# EAGLE design jammer_smdv3 (EAGLE 6.5.0)
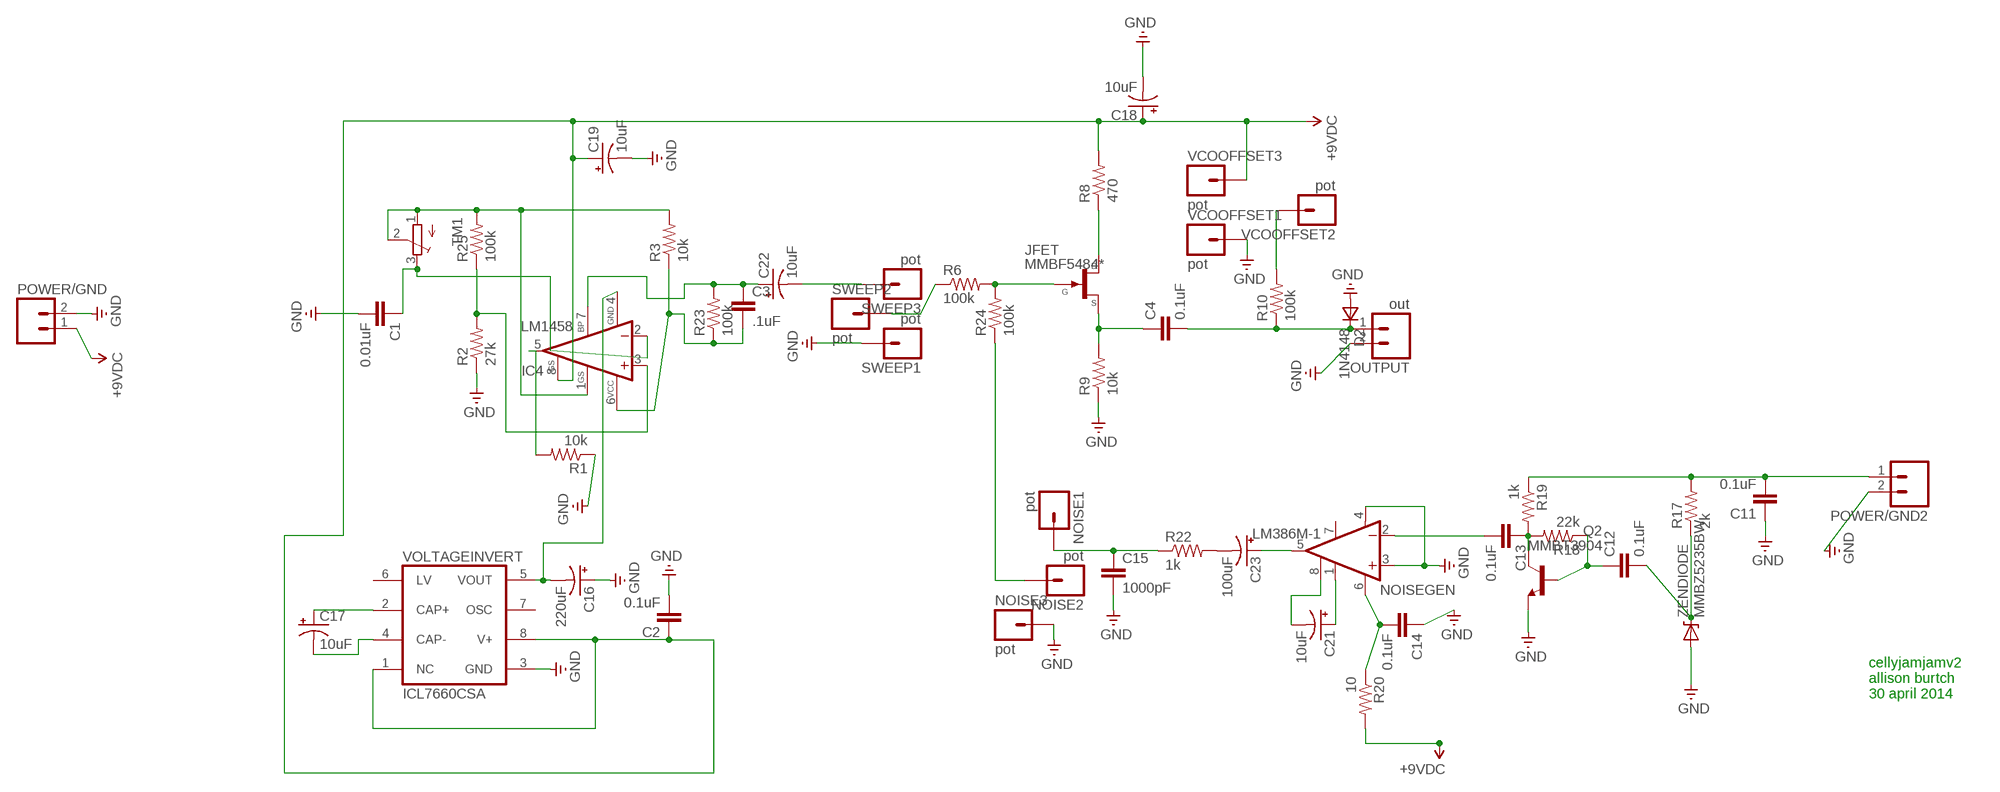
[diagram p0: schematic, sheet 1]

## Parts
C1  0.01uF  CAP0603-CAP  [0603-CAP]
C2  0.1uF  CAP0603-CAP  [0603-CAP]
C3  .1uF  CAP0603-CAP  [0603-CAP]
C4  0.1uF  CAP0603-CAP  [0603-CAP]
C11  0.1uF  CAP0603-CAP  [0603-CAP]
C12  0.1uF  CAP0603-CAP  [0603-CAP]
C13  0.1uF  CAP0603-CAP  [0603-CAP]
C14  0.1uF  CAP0603-CAP  [0603-CAP]
C15  1000pF  CAP0603-CAP  [0603-CAP]
C16  220uF  CAP_POLD  [PANASONIC_D]
C17  10uF  CAP_POLC  [PANASONIC_C]
C18  10uF  CAP_POL1206  [EIA3216]
C19  10uF  CAP_POL1206  [EIA3216]
C21  10uF  CAP_POL1206  [EIA3216]
C22  10uF  CAP_POLC  [PANASONIC_C]
C23  100uF  CAP_POLPTH1  [CPOL-RADIAL-100UF-25V]
D2  1N4148  DSOD323  [SOD323]
IC4  LM1458  LM386M  [SO08@2]
JFET  MMBF5484*  MMBF5484  [SOT23]
NOISE1  pot  M01PTH  [1X01]
NOISE2  pot  M01PTH  [1X01]
NOISE3  pot  M01PTH  [1X01]
NOISEGEN  LM386M-1  [SO08]
OUTPUT  out  M02LOCK_LONGPADS  [1X02_LOCK_LONGPADS]
POWER/GND  M02LOCK_LONGPADS  [1X02_LOCK_LONGPADS]
POWER/GND2  M02LOCK_LONGPADS  [1X02_LOCK_LONGPADS]
Q2  MMBT3904  [SOT23-BEC]
R1  10k  RESISTOR0603-RES  [0603-RES]
R2  27k  RESISTOR0603-RES  [0603-RES]
R3  10k  RESISTOR0603-RES  [0603-RES]
R6  100k  RESISTOR0603-RES  [0603-RES]
R8  470  RESISTOR0603-RES  [0603-RES]
R9  10k  RESISTOR0603-RES  [0603-RES]
R10  100k  RESISTOR0603-RES  [0603-RES]
R17  2k  RESISTOR0603-RES  [0603-RES]
R18  22k  RESISTOR0603-RES  [0603-RES]
R19  1k  RESISTOR0603-RES  [0603-RES]
R20  10  RESISTOR0603-RES  [0603-RES]
R22  1k  RESISTOR0603-RES  [0603-RES]
R23  100k  RESISTOR0603-RES  [0603-RES]
R24  100k  RESISTOR0603-RES  [0603-RES]
R25  100k  RESISTOR0603-RES  [0603-RES]
SWEEP1  pot  M01PTH  [1X01]
SWEEP2  pot  M01PTH  [1X01]
SWEEP3  pot  M01PTH  [1X01]
TM1  TRIMPOTTC33X  [TC33X]
VCOOFFSET1  pot  M01PTH  [1X01]
VCOOFFSET2  pot  M01PTH  [1X01]
VCOOFFSET3  pot  M01PTH  [1X01]
VOLTAGEINVERT  ICL7660CSA  [SO08]
ZENDIODE  MMBZ5235BW  DIODE-ZENERPTH  [DIODE-ZENER]

## Nets
GND: C1.2 C2.2 C11.1 C14.1 C15.2 C16.+ C18.C(-) C19.C(-) D2.2(A) NOISE3.1 NOISEGEN.3(+IN) NOISEGEN.4(GND) OUTPUT.2 POWER/GND2.2 POWER/GND.2 Q2.E R1.1 R2.1 R9.1 SWEEP1.1 VCOOFFSET1.1 VOLTAGEINVERT.3(GND) ZENDIODE.P$2(A)
N$4: C17.+ VOLTAGEINVERT.2(CAP+)
N$5: C17.- VOLTAGEINVERT.4(CAP-)
N$6: C21.A(+) NOISEGEN.1(GAIN)
N$7: C16.- IC4.4(GND) VOLTAGEINVERT.5(VOUT)
N$8: IC4.1(GAIN) R3.2 R25.2 TM1.1(A) TM1.2(S)
N$10: C1.1 IC4.2(-IN) TM1.3(E)
N$11: R6.1 SWEEP2.1
N$12: C22.- SWEEP3.1
N$14: C3.2 IC4.6(VS) R3.1 R23.1
N$15: C21.C(-) NOISEGEN.8(GAIN)
N$16: C12.1 Q2.B R18.1
N$18: C13.2 NOISEGEN.2(-IN)
N$19: C13.1 Q2.C R18.2 R19.2
N$20: C12.2 R17.1 ZENDIODE.P$1(C)
N$21: C23.2(-) R22.2
N$22: C23.1(+) NOISEGEN.5(OUT)
N$23: C15.1 NOISE1.1 R22.1
N$24: C3.1 C22.+ IC4.7(BS2) R23.2
N$25: NOISE2.1 R24.1
N$26: C14.2 NOISEGEN.6(VS) R20.1
N$27: JFET.1(D) R8.1
N$30: C4.1 JFET.2(S) R9.2
N$31: R10.2 VCOOFFSET2.1
N$33: C11.2 POWER/GND2.1 R17.2 R19.1
N$47: JFET.3(G) R6.2 R24.2
N$48: IC4.5(OUT) R1.2
N$49: IC4.3(+IN) R2.2 R25.1
N$52: C4.2 D2.1(C) OUTPUT.1 R10.1
VCC: C2.1 C18.A(+) C19.A(+) IC4.8(GAIN) POWER/GND.1 R8.2 R20.2 VCOOFFSET3.1 VOLTAGEINVERT.1(NC) VOLTAGEINVERT.8(V+) ; supply symbol labelled +9VDC
Unconnected: NOISEGEN.7(BYPASS) VOLTAGEINVERT.6(LV) VOLTAGEINVERT.7(OSC)

## Notes on the sheet
- cellyjamjamv2
  allison burtch
  30 april 2014

## Library data of the parts
C1-C4 C11-C15 = SparkFun-Passives:CAP: Capacitor Standard 0603 ceramic capacitor, and 0.1" leaded capacitor.
C16-C19 C21-C23 = SparkFun-Capacitors:CAP_POL: Capacitor Polarized These are standard SMD and PTH capacitors. Normally 10uF, 47uF, and 100uF in electrolytic and tantalum varieties. Always verify the external diameter of the through hole cap, it varies with capacity, voltage, and manufacturer. The EIA devices should be standard.
D2 = zetex:D: DIODE; MPN: CDSOD323-T05C; OC_FARNELL: 1824860; OC_NEWARK: 79R6078
IC4 = linear:LM386: Low Voltage Audio Power Amplifier
JFET = transistor-fet:MMBF5484*: N-Channel JFET
NOISE1-NOISE3 SWEEP1-SWEEP3 VCOOFFSET1-VCOOFFSET3 = SparkFun-Connectors:M01: Header 1 Standard 1-pin 0.1" header. Use with straight break away headers (SKU : PRT-00116), right angle break away headers (PRT-00553), swiss pins (PRT-00743), machine pins (PRT-00117), and female headers (PRT-00115).
NOISEGEN = linear:LM386?-*: Low Voltage Audio Power Amplifier Source: http://cache.national.com/ds/LM/LM386.pdf
OUTPUT POWER/GND POWER/GND2 = SparkFun-Connectors:M02: Standard 2-pin 0.1" header. Use with - straight break away headers ( PRT-00116) - right angle break away headers (PRT-00553) - swiss pins (PRT-00743) - machine pins (PRT-00117) - female headers (PRT-00115) Molex polarized connector foot print use with: PRT-08233 with associated crimp pins and housings. 2.54_SCREWTERM for use with PRT-10571. 3.5mm Screw Terminal footprints for PRT-08084 5mm Screw Terminal footprints for use with PRT-08433
Q2 = transistor-npn:MMBT3904*: NPN TRANSISTOR
R1-R3 R6 R8-R10 R17-R20 R22-R25 = SparkFun-Resistors:RESISTOR: Resistor Basic schematic elements and footprints for 0603, 1206, and PTH resistors.
TM1 = adafruit:TRIMPOT: SMT trimmer potentiometer part number TC33X http://www.ladyada.net/library/eagle
VOLTAGEINVERT = maxim:ICL7660CSA: VOLTAGE CONVERTER; MF: MAXIM; MPN: ICL7660CSA; OC_FARNELL: 9724710; OC_NEWARK: 34C3732
ZENDIODE = SparkFun-DiscreteSemi:DIODE-ZENER: Zener Diode Production Part - 8199 3.4V Zener Voltage

## Board
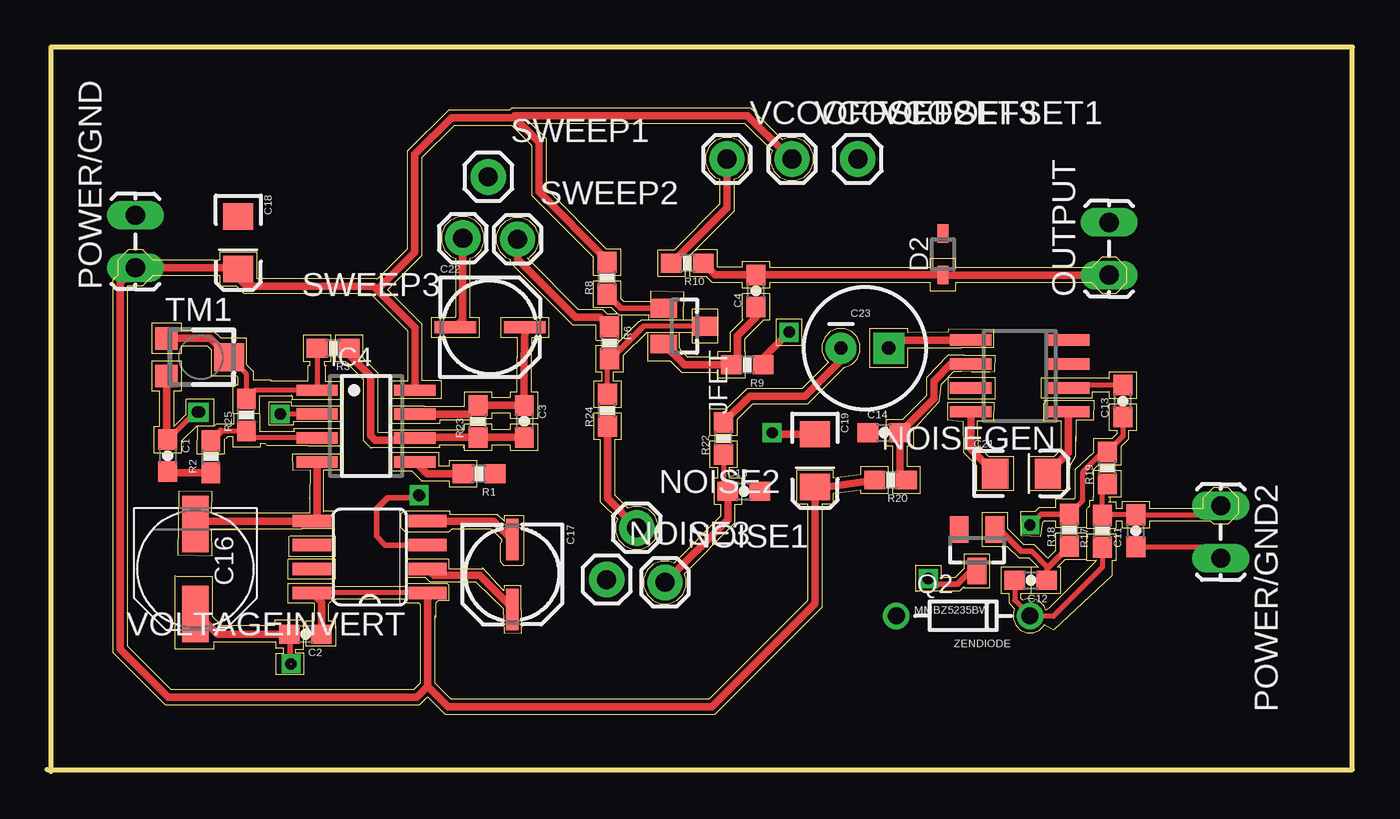
[diagram p1: board, top side]
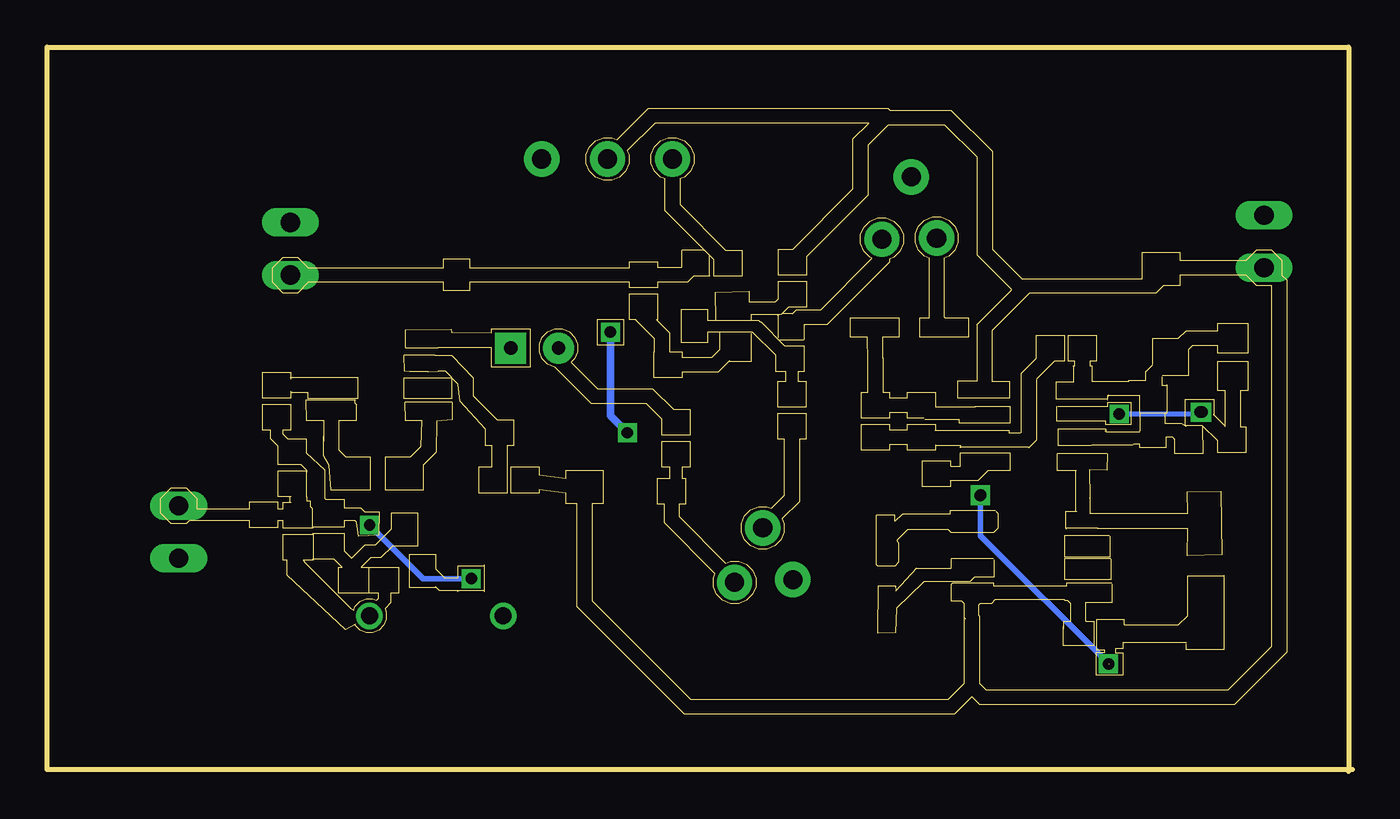
[diagram p2: board, bottom side, seen from below]

Size 69.4 x 38.5 mm. Coordinates in mm from the lower left corner, seen from the top.
Outline: 0,0.1 69.4,0.1 69.4,38.5 0.2,38.5 0.2,0
Copper layers (1*16): Top 0.035mm / dielectric 1.5mm / Bottom 0.035mm
Design rules "default": minimum track width 10mil, minimum drill 24mil, track to track 8mil, track to pad 8mil, pad to pad 8mil, via to via 8mil, smd to smd 8mil, copper to edge 40mil, drill to drill 8mil, minimum pad ring 10mil, minimum via ring 8mil, stop-mask expansion 4mil, vias tented up to drill 0mil, thermal gap 10mil
Milling: 864 lines

### Footprints (pad centres in the part's own frame; a part is rotated, then mirrored left to right if it is on the bottom)
0603-CAP = smd 1.1 x 1: 1 -0.85,0; 2 0.85,0
PANASONIC_D = smd 3 x 1.4: + 2.4,0; - -2.4,0
PANASONIC_C = smd 2.2 x 0.65: + 1.9,-0.2; - -1.8,-0.2
EIA3216 = smd 1.4 x 1.6: A 1.4,0; C -1.4,0
CPOL-RADIAL-100UF-25V = drill 0.7 pad 1.651 square: 1 1.27,0 | drill 0.7 pad 1.651: 2 -1.27,0
SOD323 = smd 1 x 0.6: 1 -1.1,0; 2 1.1,0
SO08@2 = smd 0.6 x 2.2: 1 -1.905,-2.6; 2 -0.635,-2.6; 3 0.635,-2.6; 4 1.905,-2.6; 5 1.905,2.6; 6 0.635,2.6; 7 -0.635,2.6; 8 -1.905,2.6
SOT23 = smd 1 x 1.4: 1 -0.95,-1.1; 2 0.95,-1.1; 3 0,1.1
1X01 = drill 1.016 pad 1.88: 1 0,0
SO08 = smd 0.6 x 2.2: 1 -1.905,-2.6; 2 -0.635,-2.6; 3 0.635,-2.6; 4 1.905,-2.6; 5 1.905,2.6; 6 0.635,2.6; 7 -0.635,2.6; 8 -1.905,2.6
1X02_LOCK_LONGPADS = drill 1.016 long: 1 -0.127,0; 2 2.667,0
SOT23-BEC = smd 1 x 1.4: B -0.95,-1.1; C 0,1.1; E 0.95,-1.1
0603-RES = smd 1.1 x 1: 1 -0.85,0; 2 0.85,0
TC33X = smd 1.2 x 1.2: 1 -1,-1.825; 3 1,-1.825 | smd 1.5 x 1.6: 2 0,1.5
SO08' = smd 0.66 x 2.032: 1 -1.905,-3.073; 2 -0.635,-3.073; 3 0.635,-3.073; 4 1.905,-3.073; 5 1.905,3.073; 6 0.635,3.073; 7 -0.635,3.073; 8 -1.905,3.073
DIODE-ZENER = drill 0.9: P$1 -3.556,0; P$2 3.556,0

### Placement (x,y rotation side)
C1  6.41,16.79 270 top
C2  13.74,7.29 180 top
C3  25.37,18.61 270 top
C4  37.69,25.54 90 top
C11  57.88,12.79 90 top
C12  52.3,10.16 180 top
C13  57.2,19.69 90 top
C14  44.49,18 0 top
C15  37.04,14.9 0 top
C16  7.89,10.76 270 top
C17  24.93,10.52 270 top
C18  10.17,28.1 270 top
C19  40.82,16.52 270 top
C21  51.81,15.83 0 top
C22  23.5,23.8 0 top
C23  43.48,22.5 0 top
D2  47.63,27.49 90 top
IC4  16.96,18.36 270 top
JFET  33.89,23.67 270 top
NOISE1  32.85,10.05 0 top
NOISE2  31.35,12.95 0 top
NOISE3  29.75,10.2 0 top
NOISEGEN  51.71,21.02 90 top
OUTPUT  56.46,26.51 90 top
POWER/GND  4.7,26.9 90 top
POWER/GND2  62.4,14 270 top
Q2  49.44,11.76 180 top
R1  22.97,15.82 180 top
R2  8.71,16.73 90 top
R3  15.21,22.49 180 top
R6  29.9,22.78 270 top
R8  29.78,26.22 90 top
R9  37.23,21.61 180 top
R10  34.04,27.01 180 top
R17  56.11,12.77 90 top
R18  54.35,12.82 90 top
R19  56.37,16.13 90 top
R20  44.84,15.49 180 top
R22  35.97,17.7 90 top
R23  22.91,18.61 90 top
R24  29.79,19.19 90 top
R25  10.6,18.94 90 top
SWEEP1  23.46,31.6 0 top
SWEEP2  25.02,28.29 0 top
SWEEP3  22.1,28.35 180 top
TM1  8.18,22.02 270 top
VCOOFFSET1  43.1,32.55 0 top
VCOOFFSET2  36.15,32.55 0 top
VCOOFFSET3  39.6,32.55 0 top
VOLTAGEINVERT  ICL7660CSA  [SO08']  17.16,11.4 90 top
ZENDIODE  48.7,8.28 180 top

### Tracks (layer width: path | path; a pad name or v marks a point on that pad's centre or on a via)
GND  (via drill 0.6)  (1 unrouted)
  Top 0.254: C11.1 61.79,11.94 POWER/GND2.2
  Top 0.305: C2.2 12.94,5.69 | VOLTAGEINVERT.3 17.98,12.04 17.51,12.5 17.51,13.96 18.11,14.56 19.69,14.56 v19.79,14.66
  Top 0.406: R2.1 6.47,15.88 C1.2 | C2.2 9.06,7.29 7.9,8.45 | C19.C 38.63,17.92 v38.55,18 | R9.1 38.08,21.98 v39.45,23.35
  Bottom 0.305: v19.79,14.66 19.79,12.52 12.95,5.73 12.91,5.68
  Bottom 0.406: v39.45,23.35 39.45,18.9 v38.55,18
N$4
  Top 0.406: C17.+ 24.73,8.69 22.99,10.43 20.57,10.43 VOLTAGEINVERT.2
N$5
  Top 0.406: VOLTAGEINVERT.4 23.75,13.3 C17.-
N$6
  Top 0.406: NOISEGEN.1 54.31,16.93 C21.A
N$7
  Top 0.406: IC4.4 14.36,13.58 VOLTAGEINVERT.5 8.04,13.3 C16.-
N$8
  Top 0.254: R3.2 IC4.1 11.07,20.27 R25.2 10.6,21.1 TM1.2
  Top 0.406: TM1.1 8.68,23.02 TM1.2
N$10  (via drill 0.6)
  Top 0.254: IC4.2 v12.4,19 | v8,19.1 7.87,19.1 C1.1
  Top 0.406: TM1.3 6.35,17.7 C1.1
  Bottom 0.254: v12.4,19 8.1,19 v8,19.1
N$11
  Top 0.406: SWEEP2.1 25.02,27.23 28.1,24.15 29.39,24.15 R6.1
N$12
  Top 0.406: SWEEP3.1 22.1,24.01 C22.-
N$14
  Top 0.406: C3.2 R23.1 19.59,17.76 IC4.6 19.44,17.6 17.45,17.6 17.2,17.85 17.2,21 16.06,22.14 R3.1
N$15
  Top 0.406: NOISEGEN.8 49.11,17.13 C21.C
N$16
  Top 0.305: C12.1 53.15,10.77 53.21,10.84 | 53.21,10.84 R18.1 | Q2.B 50.64,12.86 51.8,11.7 52.35,11.7 53.21,10.84
N$17  (via drill 0.6)
  other vias: 8.1,19.1
N$18
  Top 0.254: C13.2 54.45,20.54 NOISEGEN.2
N$19  (via drill 0.6)
  Top 0.254: C13.1 57.2,17.81 R19.2 56.13,16.98 55.05,15.9 55.05,14.38 R18.2
  Top 0.305: R18.2 52.87,13.67 52.3,13.1 v52.25,13.1 | Q2.C 49.11,10.66 48.4,9.95 47.15,9.95 v46.85,10.25
  Bottom 0.305: v46.85,10.25 49.4,10.25 v52.25,13.1
N$20
  Top 0.254: R17.1 56.11,10.86 53.5,8.25 52.28,8.25 ZENDIODE.P$1 51.45,9.09 C12.2
N$21
  Top 0.406: C23.2 42.21,21.86 40.3,19.95 37.37,19.95 R22.2
N$22
  Top 0.406: NOISEGEN.5 45.17,22.93 C23.1
N$23
  Top 0.254: R22.1 35.97,15.12 C15.1
  Top 0.406: C15.1 36.19,13.39 NOISE1.1
N$24
  Top 0.406: IC4.7 22.45,19 R23.2 C3.1 25.37,21.82 C22.+
N$25
  Top 0.406: R24.1 29.79,14.51 NOISE2.1
N$26
  Top 0.406: NOISEGEN.6 48.06,21.66 47.15,20.75 47.15,19.81 C14.2 45.34,15.84 R20.1
N$27
  Top 0.305: JFET.1 30.52,24.62 R8.1
N$30
  Top 0.406: JFET.2 33.89,21.61 R9.2 36.7,21.93 36.7,23.15 37.69,24.14 C4.1
N$31
  Top 0.406: VCOOFFSET2.1 36.15,29.97 R10.2
N$33
  Top 0.254: POWER/GND2.1 61.92,13.64 C11.2 56.13,13.64 R17.2 56.11,15.02 R19.1
N$43  (via drill 0.6)
  other vias: 39.45,23.35
N$47
  Top 0.254: JFET.3 31.72,23.67 31.6,23.55 | R24.2 29.79,21.82 R6.2
  Top 0.305: R6.2 29.98,21.93 31.6,23.55
N$48
  Top 0.406: R1.2 20.2,15.82 IC4.5
N$49
  Top 0.254: IC4.3 10.96,17.73 R25.1 9.22,18.09
  Top 0.406: 9.22,18.09 R2.2
N$50  (via drill 0.6)
  other vias: 12.97,5.72
N$52
  Top 0.406: R10.1 35.51,26.39 C4.2 D2.1 OUTPUT.1
N$53  (via drill 0.6)
  other vias: 19.77,14.7
VCC
  Top 0.254: VOLTAGEINVERT.1 VOLTAGEINVERT.8
  Top 0.406: R20.2 41.19,15.09 C19.A 40.82,8.92 35.35,3.45 21.32,3.45 20.23,4.53 | 9.65,26.77 POWER/GND.1 3.9,25.97 3.9,6.5 6.45,3.95 19.65,3.95 20.23,4.53 | 9.65,26.77 10.09,26.77 C18.A | IC4.8 19.56,23.59 17.55,25.6 | 17.55,25.6 17.35,25.8 10.62,25.8 9.65,26.77 | R8.2 29.78,27.18 26.15,30.8 26.15,33.45 24.85,34.75 24.75,34.75 | 24.75,34.75 21.5,34.75 19.55,32.8 19.55,27.6 17.55,25.6 | VCOOFFSET3.1 39.25,32.85 37.25,34.85 24.85,34.85 24.75,34.75 | C2.1 14.59,8.99 VOLTAGEINVERT.8 | VOLTAGEINVERT.1 20.23,4.53

### Text on the board
_tNames: VCOOFFSET2 | VCOOFFSET3 | VCOOFFSET1 | SWEEP1 | C18 | SWEEP2 | POWER/GND | C22 | SWEEP3 | R10 | D2 | R8 | C4 | OUTPUT | TM1 | R6 | C23 | R3 | JFET | IC4 | R9 | C3 | C19 | C14 | C13 | C1 | R23 | R24 | NOISEGEN | R22 | C21 | R2 | C15 | R1 | NOISE2 | R20 | R19 | POWER/GND2 | C17 | C16 | NOISE3 | NOISE1 | R18 | R17 | C11 | Q2 | C12 | VOLTAGEINVERT | ZENDIODE | C2